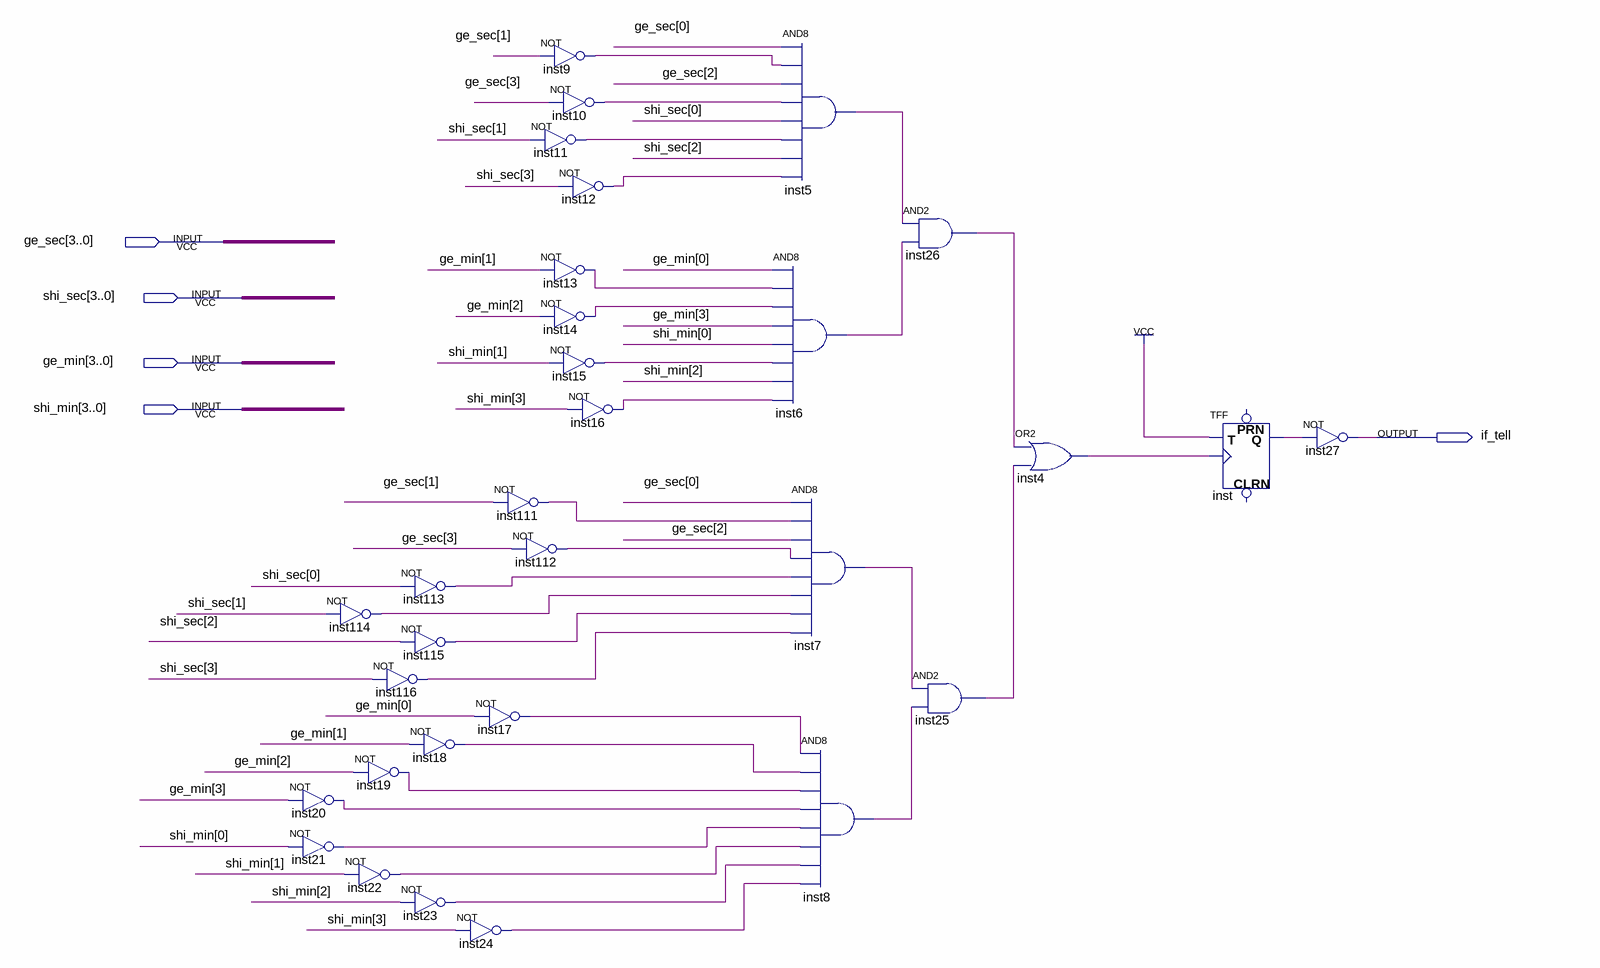
[diagram p0: schematic sheet]
// Quartus schematic tell_time.bdf as structural Verilog: 31 symbols, 5 pins
module tell_time (
  input  [3:0] ge_sec,
  input  [3:0] shi_sec,
  input  [3:0] ge_min,
  input  [3:0] shi_min,
  output if_tell
);

  wire inst4_out, inst5_out, inst6_out, inst7_out, inst8_out, inst9_out, inst10_out, inst11_out, inst12_out,
       inst13_out, inst14_out, inst15_out, inst16_out, inst17_out, inst18_out, inst19_out, inst20_out,
       inst21_out, inst22_out, inst23_out, inst24_out, inst25_out, inst26_out, inst111_out, inst112_out,
       inst113_out, inst114_out, inst115_out, inst116_out, inst_q;

  not inst114 (inst114_out, shi_sec[1]);
  not inst20 (inst20_out, ge_min[3]);
  not inst21 (inst21_out, shi_min[0]);
  not inst113 (inst113_out, shi_sec[0]);
  not inst115 (inst115_out, shi_sec[2]);
  not inst116 (inst116_out, shi_sec[3]);
  not inst19 (inst19_out, ge_min[2]);
  not inst22 (inst22_out, shi_min[1]);
  not inst23 (inst23_out, shi_min[2]);
  not inst17 (inst17_out, ge_min[0]);
  not inst18 (inst18_out, ge_min[1]);
  not inst24 (inst24_out, shi_min[3]);
  not inst9 (inst9_out, ge_sec[1]);
  not inst10 (inst10_out, ge_sec[3]);
  not inst11 (inst11_out, shi_sec[1]);
  not inst13 (inst13_out, ge_min[1]);
  not inst14 (inst14_out, ge_min[2]);
  not inst15 (inst15_out, shi_min[1]);
  not inst111 (inst111_out, ge_sec[1]);
  not inst112 (inst112_out, ge_sec[3]);
  not inst12 (inst12_out, shi_sec[3]);
  not inst16 (inst16_out, shi_min[3]);
  and inst6 (inst6_out, ge_min[0], inst13_out, inst14_out, ge_min[3], shi_min[0], inst15_out, shi_min[2], inst16_out);
  and inst5 (inst5_out, ge_sec[0], inst9_out, ge_sec[2], inst10_out, shi_sec[0], inst11_out, shi_sec[2], inst12_out);
  and inst7 (inst7_out, ge_sec[0], inst111_out, ge_sec[2], inst112_out, inst113_out, inst114_out, inst115_out, inst116_out);
  and inst8 (inst8_out, inst17_out, inst18_out, inst19_out, inst20_out, inst21_out, inst22_out, inst23_out, inst24_out);
  and inst26 (inst26_out, inst5_out, inst6_out);
  and inst25 (inst25_out, inst7_out, inst8_out);
  or inst4 (inst4_out, inst26_out, inst25_out);
  TFF inst (.T(1'b1), .CLK(inst4_out), .Q(inst_q));  // open: PRN, CLRN
  not inst27 (if_tell, inst_q);
endmodule
